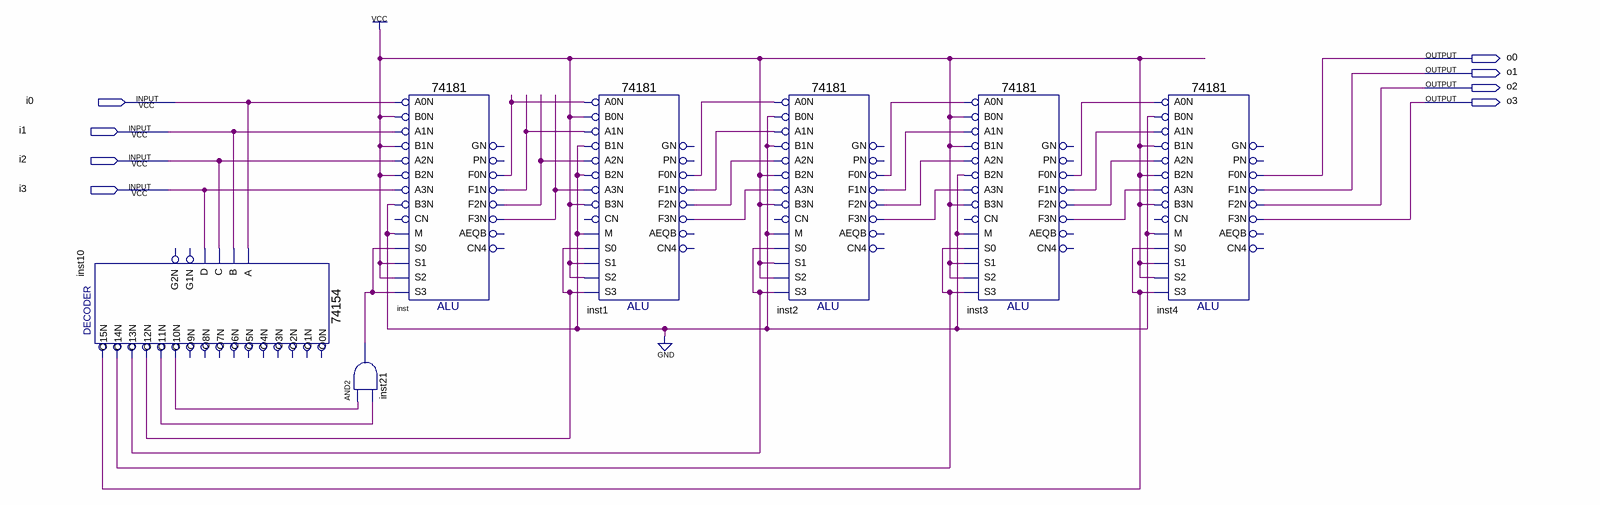
[diagram p0: schematic sheet]
// Quartus schematic special_conventer.bdf as structural Verilog: 7 symbols, 8 pins
module special_conventer (
  input  i0,
  input  i1,
  input  i2,
  input  i3,
  output o0,
  output o1,
  output o2,
  output o3
);

  wire inst1_f0n, inst1_f1n, inst1_f2n, inst1_f3n, inst2_f0n, inst2_f1n, inst2_f2n, inst2_f3n, inst3_f0n,
       inst3_f1n, inst3_f2n, inst3_f3n, inst10_o10n, inst10_o11n, inst10_o12n, inst10_o13n, inst10_o14n,
       inst10_o15n, inst21_out, inst_f0n, inst_f1n, inst_f2n, inst_f3n;

  \74154  inst10 (
    .C(i2), .D(i3), .B(i1), .A(i0), .O12N(inst10_o12n), .O15N(inst10_o15n), .O10N(inst10_o10n),
    .O11N(inst10_o11n), .O13N(inst10_o13n), .O14N(inst10_o14n));  // open: G1N, G2N, O0N, O1N, O4N, O3N, O2N, O7N, O6N, O5N, O9N, O8N
  and inst21 (inst21_out, inst10_o10n, inst10_o11n);
  \74181  inst (
    .B0N(1'b1), .A0N(i0), .A1N(i1), .B1N(1'b1), .A3N(i3), .B2N(1'b1), .A2N(i2), .M(1'b0), .B3N(1'b0),
    .S2(1'b1), .S1(1'b1), .S0(inst21_out), .S3(inst21_out), .F3N(inst_f3n), .F1N(inst_f1n), .F0N(inst_f0n),
    .F2N(inst_f2n));  // open: CN, PN, GN, AEQB, CN4
  \74181  inst1 (
    .B0N(1'b1), .A0N(inst_f0n), .A1N(inst_f1n), .B1N(1'b0), .A3N(inst_f3n), .B2N(1'b0), .A2N(inst_f2n),
    .M(1'b0), .B3N(1'b1), .S2(1'b1), .S1(1'b1), .S0(inst10_o12n), .S3(inst10_o12n), .F3N(inst1_f3n),
    .F1N(inst1_f1n), .F0N(inst1_f0n), .F2N(inst1_f2n));  // open: CN, PN, GN, AEQB, CN4
  \74181  inst2 (
    .B0N(1'b0), .A0N(inst1_f0n), .A1N(inst1_f1n), .B1N(1'b0), .A3N(inst1_f3n), .B2N(1'b1), .A2N(inst1_f2n),
    .M(1'b0), .B3N(1'b1), .S2(1'b1), .S1(1'b1), .S0(inst10_o13n), .S3(inst10_o13n), .F3N(inst2_f3n),
    .F1N(inst2_f1n), .F0N(inst2_f0n), .F2N(inst2_f2n));  // open: CN, PN, GN, AEQB, CN4
  \74181  inst3 (
    .B0N(1'b1), .A0N(inst2_f0n), .A1N(inst2_f1n), .B1N(1'b1), .A3N(inst2_f3n), .B2N(1'b0), .A2N(inst2_f2n),
    .M(1'b0), .B3N(1'b1), .S2(1'b1), .S1(1'b1), .S0(inst10_o14n), .S3(inst10_o14n), .F3N(inst3_f3n),
    .F1N(inst3_f1n), .F0N(inst3_f0n), .F2N(inst3_f2n));  // open: CN, PN, GN, AEQB, CN4
  \74181  inst4 (
    .B0N(1'b0), .A0N(inst3_f0n), .A1N(inst3_f1n), .B1N(1'b1), .A3N(inst3_f3n), .B2N(1'b1), .A2N(inst3_f2n),
    .M(1'b0), .B3N(1'b1), .S2(1'b1), .S1(1'b1), .S0(inst10_o15n), .S3(inst10_o15n), .F3N(o3), .F1N(o1),
    .F0N(o0), .F2N(o2));  // open: CN, PN, GN, AEQB, CN4
endmodule
